# Altium project ctrl_board.PrjPCB
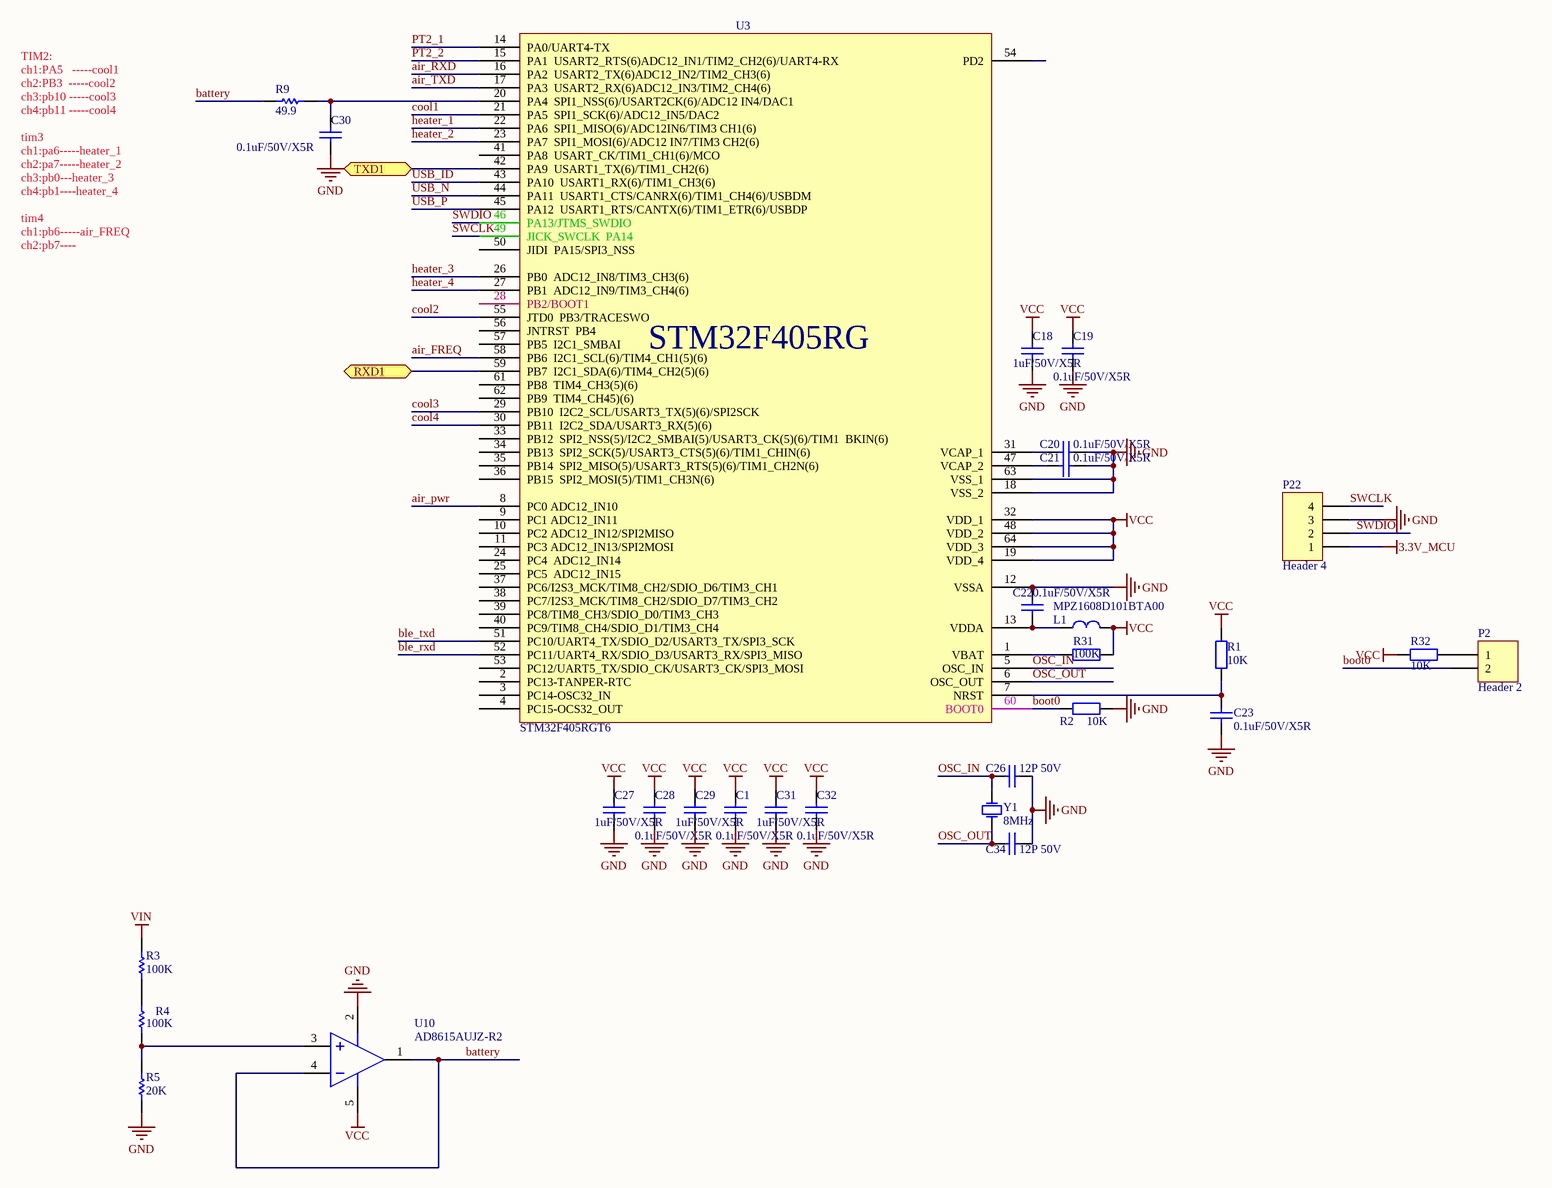
[diagram p0: cpu.SchDoc]
6 sheets, 180 parts. Net scope: flat (ports and power ports of the same name join across sheets).
Sheets:
  cpu.SchDoc
  connector.SchDoc
  power.SchDoc
  drv.SchDoc
  pt100.SchDoc
  lcd.SchDoc

## Sheet cpu.SchDoc
size A3

### Parts
C1  0.1uF/50V/X5R  [0603C]
C18  1uF/50V/X5R  [0603C]
C19  0.1uF/50V/X5R  [0603C]
C20  0.1uF/50V/X5R  [0603C]
C21  0.1uF/50V/X5R  [0603C]
C22  0.1uF/50V/X5R  [0603C]
C23  0.1uF/50V/X5R  [0603C]
C26  12P 50V  [0603C]
C27  1uF/50V/X5R  [0603C]
C28  0.1uF/50V/X5R  [0603C]
C29  1uF/50V/X5R  [0603C]
C30  0.1uF/50V/X5R  [0603C]
C31  1uF/50V/X5R  [0603C]
C32  0.1uF/50V/X5R  [0603C]
C34  12P 50V  [0603C]
L1  MPZ1608D101BTA00  [0603R]
P2  Header 2  [HDR1X2]
P22  Header 4  [HDR1X4]
R1  10K  [0603R]
R2  10K  [0603R]
R3  100K  [0603R]
R4  100K  [0603R]
R5  20K  [0603R]
R9  49.9  [0603R]
R31  100K  [0603R]
R32  10K  [0603R]
U3  STM32F405RGT6  [LQFP-64]
U10  AD8615AUJZ-R2  [sot-23-5]
Y1  8MHz  [CRAY_5032]

### Ports
RXD1 (bidir), TXD1 (bidir)

### Nets
3.3V_MCU: P22.1
GND: C1.1 C18.1 C19.1 C20.1 C21.1 C22.1 C23.1 C26.1 C27.1 C28.1 C29.1 C30.1 C31.1 C32.1 C34.1 P22.3 R2.2 R5.2 U3.12(VSSA) U3.18(VSS_2) U3.63(VSS_1) U10.2(G)
VCC: C1.2 C18.2 C19.2 C27.2 C28.2 C29.2 C31.2 C32.2 L1.2 R1.1 R31.1 R32.2 U3.19(VDD_4) U3.32(VDD_1) U3.48(VDD_2) U3.64(VDD_3) U10.5(VCC)
VIN: R3.1  [project net VCC_Heater]
air_FREQ: U3.58(PB6__I2C1_SCL(6)/TIM4_CH1(5)(6))
air_pwr: U3.8(PC0_ADC12_IN10)
air_RXD: U3.16(PA2__USART2_TX(6)ADC12_IN2/TIM2_CH3(6))
air_TXD: U3.17(PA3__USART2_RX(6)ADC12_IN3/TIM2_CH4(6))
battery: R9.1 U10.1(OS_NUL) U10.4(V-)
ble_rxd: U3.52(PC11/UART4_RX/SDIO_D3/USART3_RX/SPI3_MISO)
ble_txd: U3.51(PC10/UART4_TX/SDIO_D2/USART3_TX/SPI3_SCK)
boot0: P2.2 R2.1 U3.60(BOOT0)
cool1: U3.21(PA5__SPI1_SCK(6)/ADC12_IN5/DAC2)
cool2: U3.55(JTD0__PB3/TRACESWO)
cool3: U3.29(PB10__I2C2_SCL/USART3_TX(5)(6)/SPI2SCK)
cool4: U3.30(PB11__I2C2_SDA/USART3_RX(5)(6))
heater_1: U3.22(PA6__SPI1_MISO(6)/ADC12IN6/TIM3_CH1(6))
heater_2: U3.23(PA7__SPI1_MOSI(6)/ADC12_IN7/TIM3_CH2(6))
heater_3: U3.26(PB0__ADC12_IN8/TIM3_CH3(6))
heater_4: U3.27(PB1__ADC12_IN9/TIM3_CH4(6))
OSC_IN: C26.2 U3.5(OSC_IN) Y1.2(OSC2)
OSC_OUT: C34.2 U3.6(OSC_OUT) Y1.1(OSC1)
PT2_1: U3.14(PA0/UART4-TX)
PT2_2: U3.15(PA1__USART2_RTS(6)ADC12_IN1/TIM2_CH2(6)/UART4-RX)
SWCLK: P22.4 U3.49(JICK_SWCLK__PA14)
SWDIO: P22.2 U3.46(PA13/JTMS_SWDIO)
USB_ID: U3.43(PA10__USART1_RX(6)/TIM1_CH3(6))
USB_N: U3.44(PA11__USART1_CTS/CANRX(6)/TIM1_CH4(6)/USBDM)
USB_P: U3.45(PA12__USART1_RTS/CANTX(6)/TIM1_ETR(6)/USBDP)
NetC20_2: C20.2 U3.31(VCAP_1)
NetC21_2: C21.2 U3.47(VCAP_2)
NetC22_2: C22.2 L1.1 U3.13(VDDA)
NetC23_2: C23.2 R1.2 U3.7(NRST)
NetC30_2: C30.2 R9.2 U3.20(PA4__SPI1_NSS(6)/USART2CK(6)/ADC12_IN4/DAC1)
NetP2_1: P2.1 R32.1
NetR3_2: R3.2 R4.1
NetR4_2: R4.2 R5.1 U10.3(V+)
NetR10#1_2: U3.42(PA9__USART1_TX(6)/TIM1_CH2(6)) ; port TXD1
NetR31_2: R31.2 U3.1(VBAT)
NetR63#1_2: U3.59(PB7__I2C1_SDA(6)/TIM4_CH2(5)(6)) ; port RXD1

Not connected (* = marked no-connect by the designer): U3 2(PC13-TANPER-RTC) 3(PC14-OSC32_IN) 4(PC15-OCS32_OUT) 9(PC1_ADC12_IN11) 10(PC2_ADC12_IN12/SPI2MISO) 11(PC3_ADC12_IN13/SPI2MOSI) 24(PC4__ADC12_IN14) 25(PC5__ADC12_IN15) 28(PB2/BOOT1) 33(PB12__SPI2_NSS(5)/I2C2_SMBAI(5)/USART3_CK(5)(6)/TIM1__BKIN(6)) 34(PB13__SPI2_SCK(5)/USART3_CTS(5)(6)/TIM1_CHIN(6)) 35(PB14__SPI2_MISO(5)/USART3_RTS(5)(6)/TIM1_CH2N(6)) 36(PB15__SPI2_MOSI(5)/TIM1_CH3N(6)) 37(PC6/I2S3_MCK/TIM8_CH2/SDIO_D6/TIM3_CH1) 38(PC7/I2S3_MCK/TIM8_CH2/SDIO_D7/TIM3_CH2) 39(PC8/TIM8_CH3/SDIO_D0/TIM3_CH3) 40(PC9/TIM8_CH4/SDIO_D1/TIM3_CH4) 41(PA8__USART_CK/TIM1_CH1(6)/MCO) 50(JIDI__PA15/SPI3_NSS) 53(PC12/UART5_TX/SDIO_CK/USART3_CK/SPI3_MOSI) 54(PD2) 56(JNTRST__PB4) 57(PB5__I2C1_SMBAI) 61(PB8__TIM4_CH3(5)(6)) 62(PB9__TIM4_CH45)(6))

### Notes on the sheet
- TIM2:
  ch1:PA5   -----cool1
  ch2:PB3  -----cool2
  ch3:pb10 -----cool3
  ch4:pb11 -----cool4
  tim3
  ch1:pa6-----heater_1
  ch2:pa7-----heater_2
  ch3:pb0---heater_3
  ch4:pb1----heater_4
  tim4
  ch1:pb6-----air_FREQ
  ch2:pb7----

### Library data of the parts
C1 C18-C23 C26-C32 C34 = CAP4: 贴片电容 20%
L1 = CIZHU1: 磁珠电感 100R 100MHz
P2 = Header 2: Header, 2-Pin; LatestRevisionDate: 17-Jul-2002; LatestRevisionNote: Re-released for DXP Platform.; Publisher: Altium Limited
P22 = Header 4: Header, 4-Pin; LatestRevisionDate: 17-Jul-2002; LatestRevisionNote: Re-released for DXP Platform.; Publisher: Altium Limited
R1 R2 R31 R32 = RES2: 贴片电阻 5%
R3-R5 R9 = Res1: Resistor; Published: 8-Jun-2000; LatestRevisionDate: 17-Jul-2002; LatestRevisionNote: Re-released for DXP Platform.; PackageReference: AXIAL-0.3; Publisher: Altium Limited
U3 = STM32F405RG: MCU
U10 = AD8615
Y1 = XTAL: 晶振

## Sheet connector.SchDoc
size A4
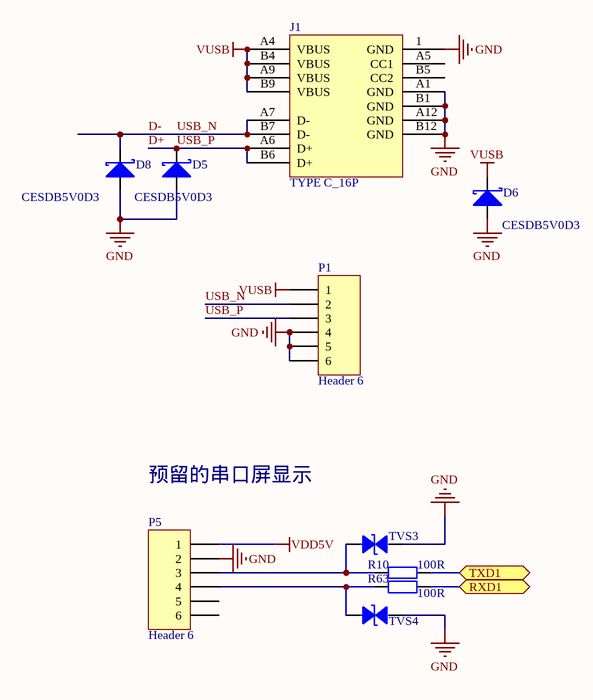
[diagram p1: connector.SchDoc]

### Parts
(Parts that share a designator on the sheet are numbered #1, #2 ... from top to bottom, then left to right.)
D5  CESDB5V0D3  [SOD323]
D6  CESDB5V0D3  [SOD323]
D8  CESDB5V0D3  [SOD323]
J1  TYPE C_16P  [TYPEC_16P]
P1  Header 6  [USB-A]
P5#1  Header 6  [6X2MMZ]
R10#1  100R  [0603R]
R63#1  100R  [0603R]
TVS3#1  ESD5Z5.0CT1G  [SOD-523]  (value not drawn)
TVS4#1  ESD5Z5.0CT1G  [SOD-523]  (value not drawn)

### Ports
RXD1 (bidir), TXD1 (bidir)

### Nets
GND: D5.1(A) D6.1(A) D8.1(A) J1.1(GND) J1.A1(GND) J1.A12(GND) J1.B1(GND) J1.B12(GND) P1.4 P1.5 P1.6 P5#1.2 TVS3#1.1(A) TVS4#1.1(A)
VDD5V: P5#1.1
VUSB: D6.2(K) J1.A4(VBUS) J1.A9(VBUS) J1.B4(VBUS) J1.B9(VBUS) P1.1
D+: D5.2(K) J1.A6(D+) J1.B6(D+) P1.3  [also labelled USB_P]
D-: D8.2(K) J1.A7(D-) J1.B7(D-) P1.2  [also labelled USB_N]
NetP5#1_3: P5#1.3 R10#1.1 TVS3#1.2(B)
NetP5#1_4: P5#1.4 R63#1.1 TVS4#1.2(B)
NetR10#1_2: R10#1.2 ; port TXD1
NetR63#1_2: R63#1.2 ; port RXD1

Not connected (* = marked no-connect by the designer): J1 A5(CC1) B5(CC2); P5#1 5 6

### Notes on the sheet
- 预留的串口屏显示

### Library data of the parts
D5 D6 D8 = DIODE S: Schottky Diode
P1 P5#1 = Header 6: Header, 6-Pin; LatestRevisionDate: 17-Jul-2002; LatestRevisionNote: Re-released for DXP Platform.; Publisher: Altium Limited
R10#1 R63#1 = RES2: 贴片电阻 5%
TVS3#1 TVS4#1 = TVS-1: TVS

## Sheet power.SchDoc
size A4
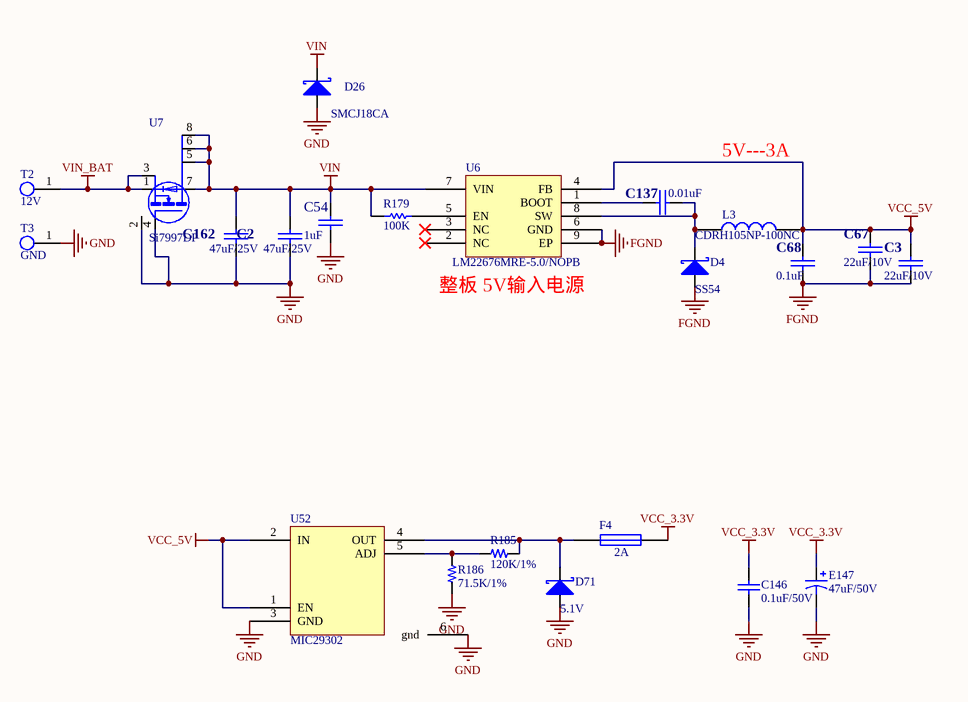
[diagram p2: power.SchDoc]

### Parts
C2  47uF/25V  [1210C]
C3  22uF/10V  [1210C]
C54  1uF  [0603C]
C67  22uF/10V  [1210C]
C68  0.1uF  [0603C]
C137  0.01uF  [0603C]
C146  0.1uF/50V  [0603C]
C162  47uF/25V  [1210C]
D4  SS54  [SMC]
D26  SMCJ18CA  [SMC]
D71  5.1V  [SMA]
E147  47uF/50V  [Φ10×10]
F4  2A  [1812-F]
L3  CDRH105NP-100NC  [CDRH105]
R179  100K  [0603R]
R185  120K/1%  [0603R]
R186  71.5K/1%  [0603R]
T2  12V  [FIX-4.5]
T3  GND  [FIX-4.5]
U6  LM22676MRE-5.0/NOPB  [SOP127P600X168_HS-8N]
U7  Si7997DP  [SC-70(PowerPAK)]
U52  MIC29302  [TO228P1435X457-6N]

### Nets
FGND: C3.2 C67.2 C68.2 D4.1(A) U6.6(GND) U6.9(EP)
GND: C2.2 C54.1 C146.1 C162.2 D26.1(A) D71.1(A) E147.2 R186.1 T3.1 U7.2(G) U7.4(G) U52.3(GND) U52.6(gnd)
VCC_3.3V: C146.2 E147.1 F4.2
VCC_5V: C3.1 C67.1 C68.1 L3.2 U6.4(FB) U52.1(EN) U52.2(IN)
VIN: C2.1 C54.2 C162.1 D26.2(K) R179.2 U6.7(VIN) U7.5(D) U7.6(D) U7.7(D) U7.8(D)  [project net VCC_Heater]
VIN_BAT: T2.1 U7.1(S) U7.3(S)
NetC137_1: C137.1 D4.2(K) L3.1 U6.8(SW)
NetC137_2: C137.2 U6.1(BOOT)
NetD71_2: D71.2(K) F4.1 R185.1 U52.4(OUT)
NetR179_1: R179.1 U6.5(EN)
NetR185_2: R185.2 R186.2 U52.5(ADJ)

Not connected (* = marked no-connect by the designer): U6 2(NC)* 3(NC)*

### Notes on the sheet
- 5V---3A
- (near U6) 整板 5V输入电源

### Library data of the parts
C2 C3 C54 C67 C68 C137 C162 = CAP: Capacitor
C146 = Cap: Capacitor; Value: 22nF; Published: 8-Jun-2000; LatestRevisionDate: 17-Jul-2002; LatestRevisionNote: Re-released for DXP Platform.; PackageReference: RAD-0.3; Publisher: Altium Limited; PackageDescription: Radial Cap, Thru-Hole; 2 Leads; 0.3 in Pin Spacing
D4 D26 D71 = DIODE S: Schottky Diode
E147 = Cap Pol1: Polarized Capacitor (Radial); Value: 100pF; Published: 8-Jun-2000; LatestRevisionDate: 17-Jul-2002; LatestRevisionNote: Re-released for DXP Platform.; PackageReference: RB7.6-15; Publisher: Altium Limited
F4 = Fuse 1: Fuse; Published: 8-Jun-2000; LatestRevisionDate: 17-Jul-2002; LatestRevisionNote: Re-released for DXP Platform.; PackageReference: PIN-W2/E2.8; Publisher: Altium Limited; PackageDescription: Thru-Hole; 2 Leads
L3 = INDUCTOR
R179 = Res1: Resistor; Published: 8-Jun-2000; LatestRevisionDate: 17-Jul-2002; LatestRevisionNote: Re-released for DXP Platform.; PackageReference: AXIAL-0.3; Publisher: Altium Limited
R185 R186 = R
T2 T3 = TP
U6 = LM22676MR-5.0
U7 = Si7997DP: Sia430DJ

## Sheet drv.SchDoc
size A2
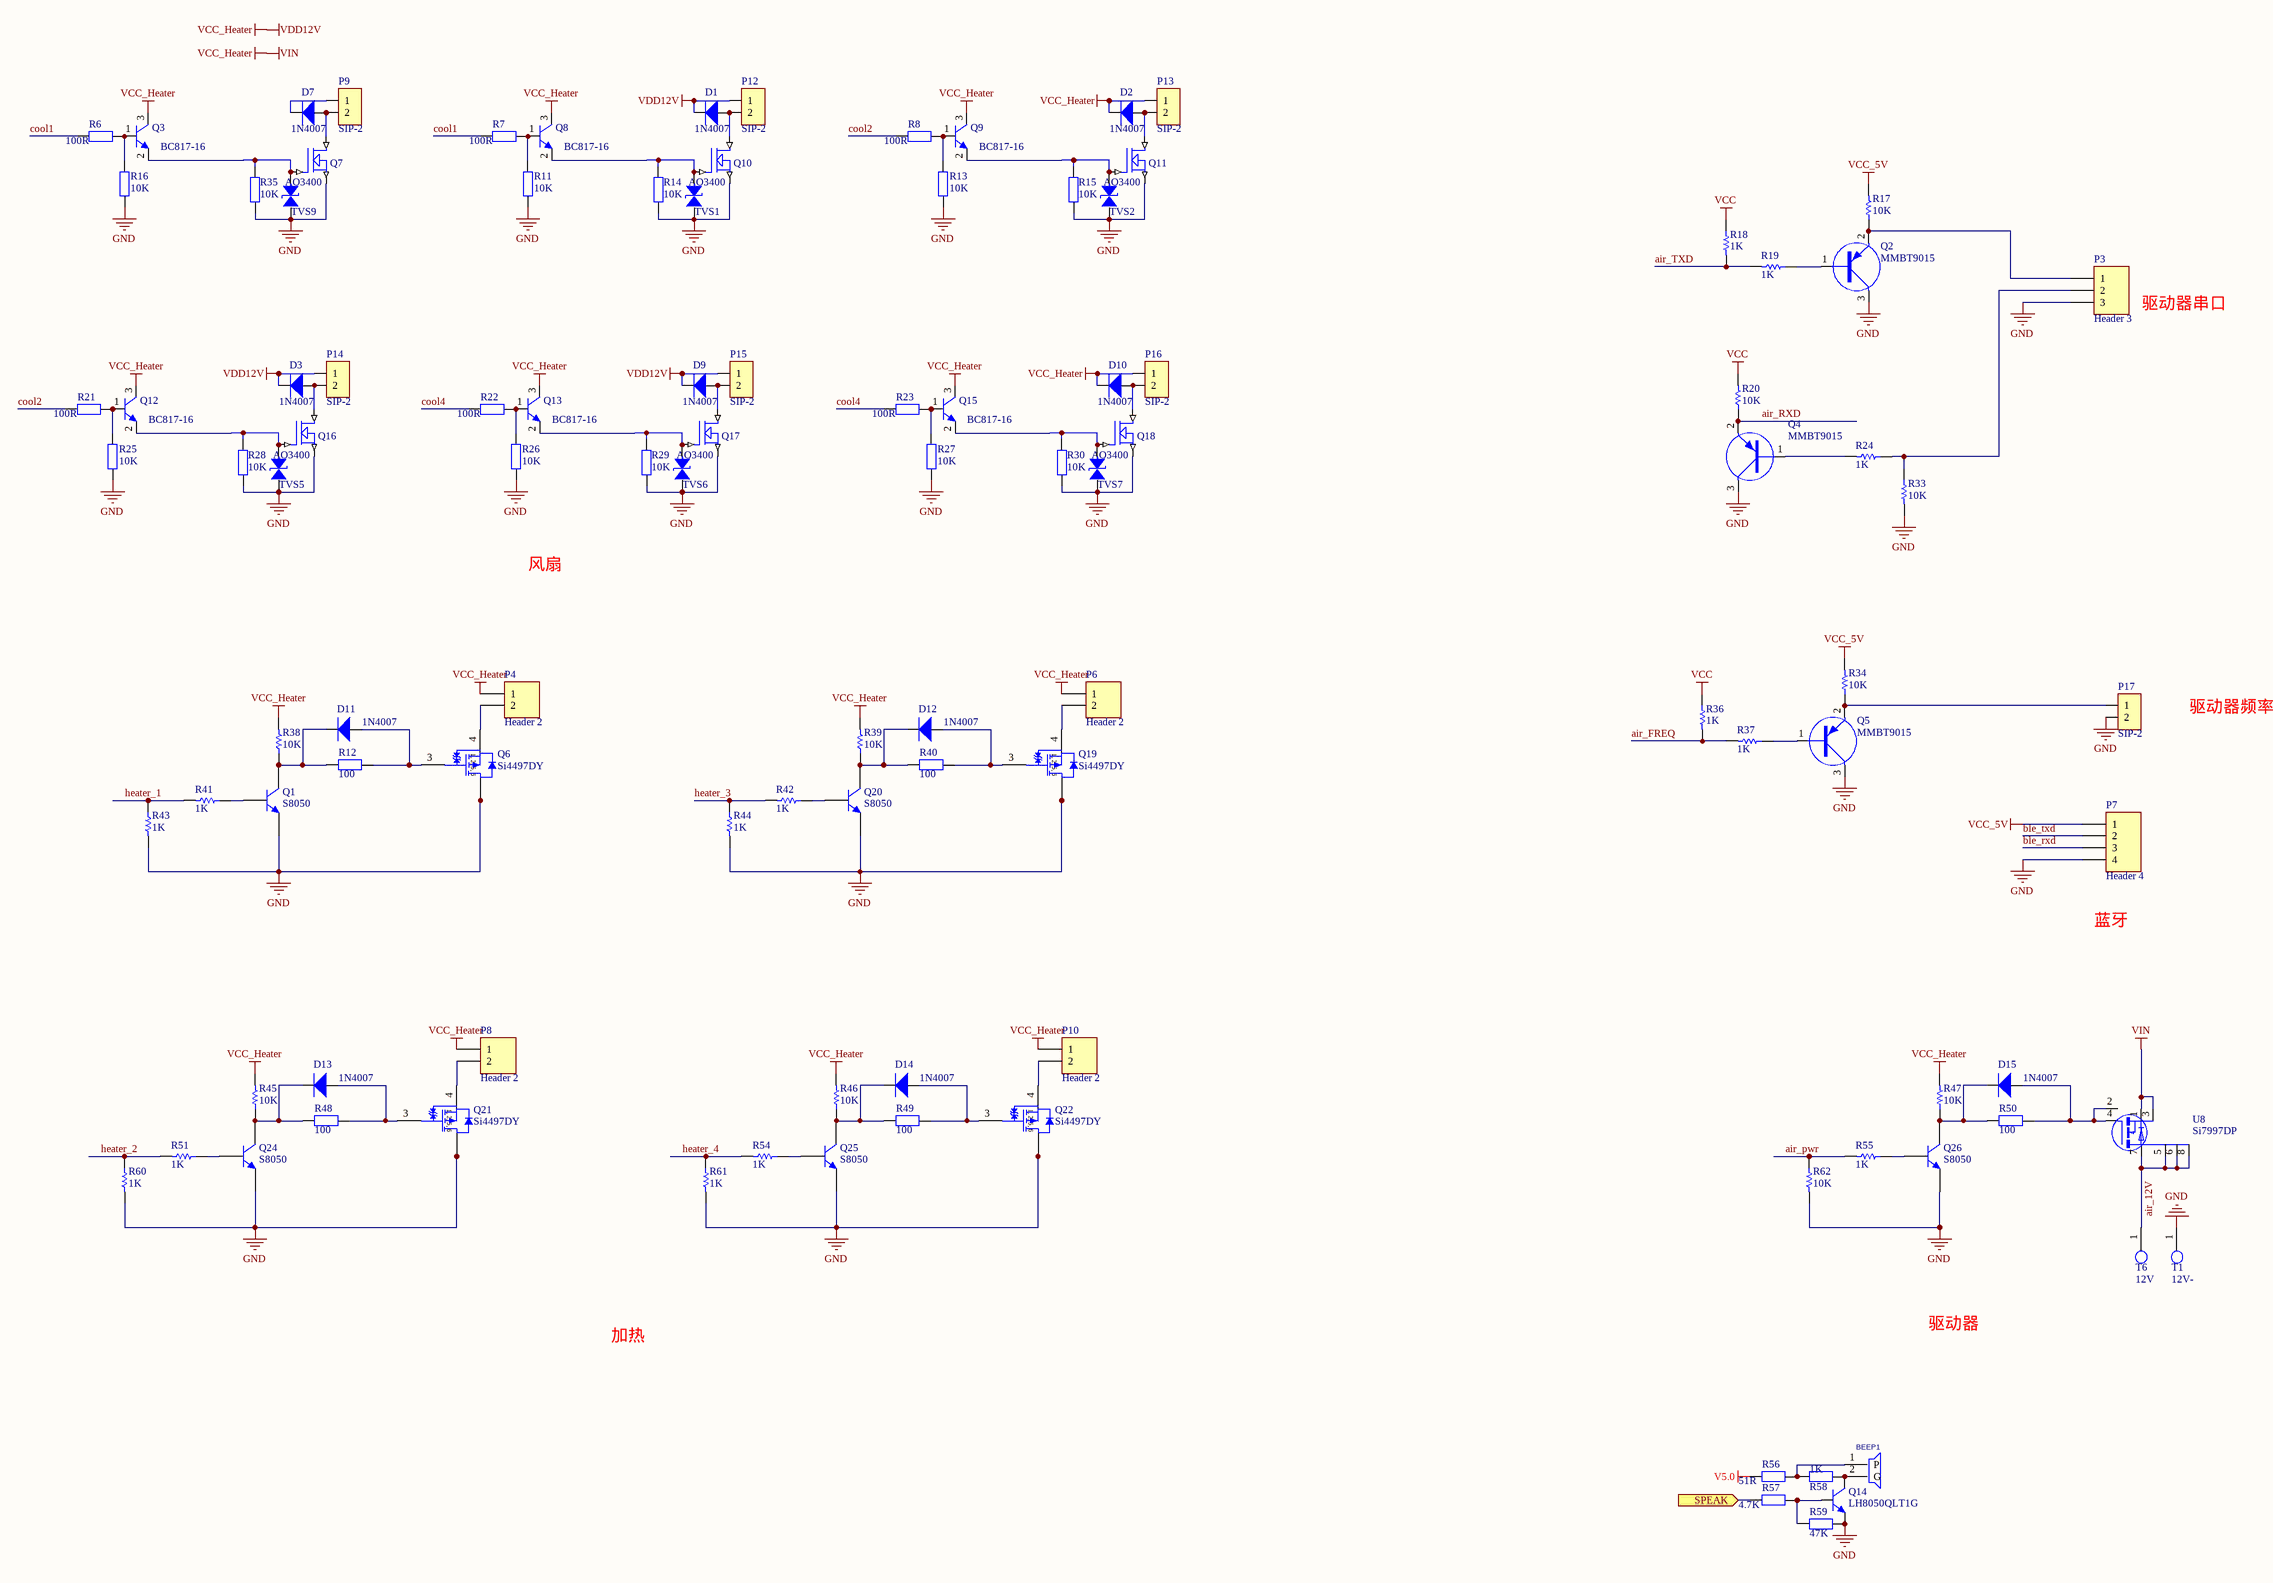
[diagram p3: drv.SchDoc]

### Parts
BEEP1  BEEP-9.5X5.5  [BEEP-9.5X5.5]  (value not drawn)
D1  1N4007  [DO-214-AC]
D2  1N4007  [DO-214-AC]
D3  1N4007  [DO-214-AC]
D7  1N4007  [DO-214-AC]
D9  1N4007  [DO-214-AC]
D10  1N4007  [DO-214-AC]
D11  1N4007  [DO-214-AC]
D12  1N4007  [DO-214-AC]
D13  1N4007  [DO-214-AC]
D14  1N4007  [DO-214-AC]
D15  1N4007  [DO-214-AC]
P3  Header 3  [HDR1X3]
P4  Header 2  [HDR1X2]
P6  Header 2  [HDR1X2]
P7  Header 4  [HDR1X4]
P8  Header 2  [HDR1X2]
P9  SIP-2  [SIP-2A]
P10  Header 2  [HDR1X2]
P12  SIP-2  [SIP-2A]
P13  SIP-2  [SIP-2A]
P14  SIP-2  [SIP-2A]
P15  SIP-2  [SIP-2A]
P16  SIP-2  [SIP-2A]
P17  SIP-2  [SIP-2A]
Q1  S8050  [SOT23-3]
Q2  MMBT9015  [SOT23-3]
Q3  BC817-16  [SOT-23]
Q4  MMBT9015  [SOT23-3]
Q5  MMBT9015  [SOT23-3]
Q6  Si4497DY
Q7  AO3400  [SOT-23]
Q8  BC817-16  [SOT-23]
Q9  BC817-16  [SOT-23]
Q10  AO3400  [SOT-23]
Q11  AO3400  [SOT-23]
Q12  BC817-16  [SOT-23]
Q13  BC817-16  [SOT-23]
Q14  LH8050QLT1G  [SOT-23]
Q15  BC817-16  [SOT-23]
Q16  AO3400  [SOT-23]
Q17  AO3400  [SOT-23]
Q18  AO3400  [SOT-23]
Q19  Si4497DY
Q20  S8050  [SOT23-3]
Q21  Si4497DY
Q22  Si4497DY
Q24  S8050  [SOT23-3]
Q25  S8050  [SOT23-3]
Q26  S8050  [SOT23-3]
R6  100R  [0603R]
R7  100R  [0603R]
R8  100R  [0603R]
R11  10K  [0603R]
R12  100  [0603R]
R13  10K  [0603R]
R14  10K  [0603R]
R15  10K  [0603R]
R16  10K  [0603R]
R17  10K  [0603R]
R18  1K  [0603R]
R19  1K  [0603R]
R20  10K  [0603R]
R21  100R  [0603R]
R22  100R  [0603R]
R23  100R  [0603R]
R24  1K  [0603R]
R25  10K  [0603R]
R26  10K  [0603R]
R27  10K  [0603R]
R28  10K  [0603R]
R29  10K  [0603R]
R30  10K  [0603R]
R33  10K  [0603R]
R34  10K  [0603R]
R35  10K  [0603R]
R36  1K  [0603R]
R37  1K  [0603R]
R38  10K  [0603R]
R39  10K  [0603R]
R40  100  [0603R]
R41  1K  [0603R]
R42  1K  [0603R]
R43  1K  [0603R]
R44  1K  [0603R]
R45  10K  [0603R]
R46  10K  [0603R]
R47  10K  [0603R]
R48  100  [0603R]
R49  100  [0603R]
R50  100  [0603R]
R51  1K  [0603R]
R54  1K  [0603R]
R55  1K  [0603R]
R56  51R  [0603R]
R57  4.7K  [0603R]
R58  1K  [0603R]
R59  47K  [0603R]
R60  1K  [0603R]
R61  1K  [0603R]
R62  10K  [0603R]
T1  12V-  [FIX-4.5]
T6  12V  [FIX-4.5]
TVS1  ESD5Z5.0CT1G  [SOD-523]  (value not drawn)
TVS2  ESD5Z5.0CT1G  [SOD-523]  (value not drawn)
TVS5  ESD5Z5.0CT1G  [SOD-523]  (value not drawn)
TVS6  ESD5Z5.0CT1G  [SOD-523]  (value not drawn)
TVS7  ESD5Z5.0CT1G  [SOD-523]  (value not drawn)
TVS9  ESD5Z5.0CT1G  [SOD-523]  (value not drawn)
U8  Si7997DP  [SC-70(PowerPAK)]

### Ports
SPEAK (in)

### Nets
GND: P3.3 P7.4 P17.2 Q1.2(E) Q2.3(C) Q4.3(C) Q5.3(C) Q6.1(D) Q6.2(D) Q6.5(D) Q6.6(D) Q7.2(S) Q10.2(S) Q11.2(S) Q14.2(E) Q16.2(S) Q17.2(S) Q18.2(S) Q19.1(D) Q19.2(D) Q19.5(D) Q19.6(D) Q20.2(E) Q21.1(D) Q21.2(D) Q21.5(D) Q21.6(D) Q22.1(D) Q22.2(D) Q22.5(D) Q22.6(D) Q24.2(E) Q25.2(E) Q26.2(E) R11.1 R13.1 R14.2 R15.2 R16.1 R25.1 R26.1 R27.1 R28.2 R29.2 R30.2 R33.2 R35.2 R43.2 R44.2 R59.2 R60.2 R61.2 R62.2 T1.1 TVS1.1(A) TVS2.1(A) TVS5.1(A) TVS6.1(A) TVS7.1(A) TVS9.1(A)
V5.0: R56.2
VCC: R18.1 R20.2 R36.1
VCC_5V: P7.1 R17.2 R34.2
VCC_Heater: D1.2(K) D2.2(K) D3.2(K) D9.2(K) D10.2(K) P4.1 P6.1 P8.1 P10.1 P12.1 P13.1 P14.1 P15.1 P16.1 Q3.3(C) Q8.3(C) Q9.3(C) Q12.3(C) Q13.3(C) Q15.3(C) R38.2 R39.2 R45.2 R46.2 R47.2 U8.1(S) U8.3(S)  [also labelled VDD12V, VIN]
air_12V: T6.1 U8.5(D) U8.6(D) U8.7(D) U8.8(D)
air_FREQ: R36.2 R37.2
air_pwr: R55.2 R62.1
air_RXD: Q4.2(E) R20.1
air_TXD: R18.2 R19.2
ble_rxd: P7.3
ble_txd: P7.2
cool1: R6.2 R7.2
cool2: R8.2 R21.2
cool4: R22.2 R23.2
heater_1: R41.2 R43.1
heater_2: R51.2 R60.1
heater_3: R42.2 R44.1
heater_4: R54.2 R61.1
NetBEEP1_1: BEEP1.1(P) R56.1 R58.2
NetBEEP1_2: BEEP1.2(G) Q14.3(C) R58.1
NetD1_1: D1.1(A) P12.2 Q10.3(D)
NetD2_1: D2.1(A) P13.2 Q11.3(D)
NetD3_1: D3.1(A) P14.2 Q16.3(D)
NetD7_1: D7.1(A) P9.2 Q7.3(D)
NetD7_2: D7.2(K) P9.1
NetD9_1: D9.1(A) P15.2 Q17.3(D)
NetD10_1: D10.1(A) P16.2 Q18.3(D)
NetD11_1: D11.1(A) Q6.3(G) R12.2
NetD11_2: D11.2(K) Q1.3(C) R12.1 R38.1
NetD12_1: D12.1(A) Q19.3(G) R40.2
NetD12_2: D12.2(K) Q20.3(C) R39.1 R40.1
NetD13_1: D13.1(A) Q21.3(G) R48.2
NetD13_2: D13.2(K) Q24.3(C) R45.1 R48.1
NetD14_1: D14.1(A) Q22.3(G) R49.2
NetD14_2: D14.2(K) Q25.3(C) R46.1 R49.1
NetD15_1: D15.1(A) R50.2 U8.2(G) U8.4(G)
NetD15_2: D15.2(K) Q26.3(C) R47.1 R50.1
NetP3_1: P3.1 Q2.2(E) R17.1
NetP3_2: P3.2 R24.1 R33.1
NetP4_2: P4.2 Q6.4(S)
NetP6_2: P6.2 Q19.4(S)
NetP8_2: P8.2 Q21.4(S)
NetP10_2: P10.2 Q22.4(S)
NetP17_1: P17.1 Q5.2(E) R34.1
NetQ1_1: Q1.1(B) R41.1
NetQ2_1: Q2.1(B) R19.1
NetQ3_1: Q3.1(B) R6.1 R16.2
NetQ3_2: Q3.2(E) Q7.1(G) R35.1 TVS9.2(B)
NetQ4_1: Q4.1(B) R24.2
NetQ5_1: Q5.1(B) R37.1
NetQ8_1: Q8.1(B) R7.1 R11.2
NetQ8_2: Q8.2(E) Q10.1(G) R14.1 TVS1.2(B)
NetQ9_1: Q9.1(B) R8.1 R13.2
NetQ9_2: Q9.2(E) Q11.1(G) R15.1 TVS2.2(B)
NetQ12_1: Q12.1(B) R21.1 R25.2
NetQ12_2: Q12.2(E) Q16.1(G) R28.1 TVS5.2(B)
NetQ13_1: Q13.1(B) R22.1 R26.2
NetQ13_2: Q13.2(E) Q17.1(G) R29.1 TVS6.2(B)
NetQ14_1: Q14.1(B) R57.2 R59.1
NetQ15_1: Q15.1(B) R23.1 R27.2
NetQ15_2: Q15.2(E) Q18.1(G) R30.1 TVS7.2(B)
NetQ20_1: Q20.1(B) R42.1
NetQ24_1: Q24.1(B) R51.1
NetQ25_1: Q25.1(B) R54.1
NetQ26_1: Q26.1(B) R55.1
NetR57_1: R57.1 ; port SPEAK

### Notes on the sheet
- 驱动器串口
- 风扇
- 驱动器频率控制
- 蓝牙
- 加热
- 驱动器
- (in symbol SQ3419AEEV-T1_GE3) 1, 2, 5, 6

### Library data of the parts
D1-D3 D7 D9-D15 = DIODE2: 贴片二极管
P3 = Header 3: Header, 3-Pin; LatestRevisionDate: 17-Jul-2002; LatestRevisionNote: Re-released for DXP Platform.; Publisher: Altium Limited
P4 P6 P8 P10 = Header 2: Header, 2-Pin; LatestRevisionDate: 17-Jul-2002; LatestRevisionNote: Re-released for DXP Platform.; Publisher: Altium Limited
P7 = Header 4: Header, 4-Pin; LatestRevisionDate: 17-Jul-2002; LatestRevisionNote: Re-released for DXP Platform.; Publisher: Altium Limited
P9 P12-P17 = SIP-2: XH2.54 2P 立贴
Q1 Q20 Q24-Q26 = NPN: NPN Bipolar Transistor; Published: 8-Jun-2000; LatestRevisionDate: 17-Jul-2002; LatestRevisionNote: Re-released for DXP Platform.; PackageReference: TO-226; Publisher: Altium Limited; Code_JEDEC: TO-226-AA
Q2 Q4 Q5 = PNP
Q3 Q8 Q9 Q12 Q13 Q15 = NPN-1: 三极管
Q6 Q19 Q21 Q22 = SQ3419AEEV-T1_GE3: Automotive P-Channel MOSFET, 6.9 A, 40 V, -55 to 175 degC, 6-Pin TSOP, RoHS, Tape and Reel; Manufacturer: International Rectifier; Rated Power Dissipation: 2W; Qg Gate Charge: 25nC; Drain-to-Source Voltage [Vdss]: 40V; Drain-Source On Resistance-Max: 112mO; Channel Type: P-Channel; Package Description: 6-Pin Thin Small Outline Package, Body 3 x 1.65 mm, Pitch 1.00 mm; Datasheet URL: https://www.vishay.com/docs/65332/sq3419aeev.pdf; Mounting Technology: SurfaceMount; Package Reference: TSOP-6; Manufacturer URL: https://www.vishay.com/; Datasheet Version: 04/2010
Q7 Q10 Q11 Q16-Q18 = MOSFET N
Q14 = NPN-1: NPN
R6-R8 R11-R16 R21-R23 R25-R30 R35 R40 R48-R50 = RES-SOP: 贴片电阻 5%
R17-R20 R24 R33 R34 R36-R39 R41-R47 R51 R54 R55 R60-R62 = Res1: Resistor; Published: 8-Jun-2000; LatestRevisionDate: 17-Jul-2002; LatestRevisionNote: Re-released for DXP Platform.; PackageReference: AXIAL-0.3; Publisher: Altium Limited
R56-R59 = RES0: 贴片电阻 5%
T1 T6 = TP
TVS1 TVS2 TVS5-TVS7 TVS9 = TVS-1: TVS
U8 = Si7997DP: Sia430DJ
BEEP1 = BEEP-9.5X5.5: PCB DECAL: BEEP-9.5X5.5

## Sheet pt100.SchDoc
size A4
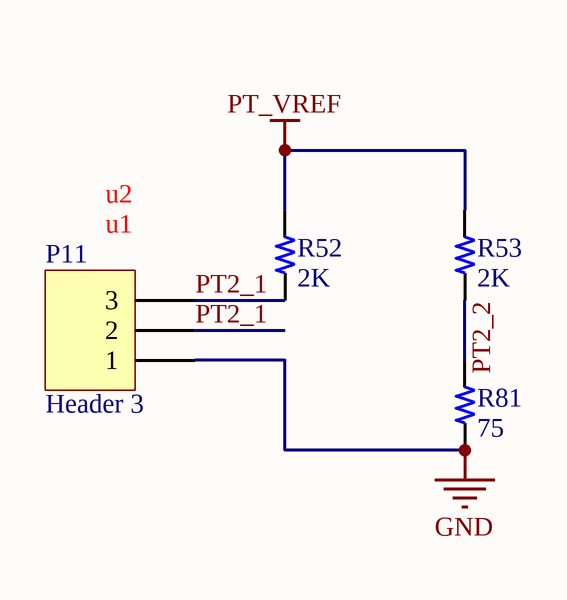
[diagram p4: pt100.SchDoc]

### Parts
P11  Header 3  [KF7.62-3P]
R52  2K  [0603R]
R53  2K  [0603R]
R81  75  [0603R]

### Nets
GND: P11.1 R81.1
PT_VREF: R52.2 R53.2
PT2_1: P11.2 P11.3 R52.1
PT2_2: R53.1 R81.2

### Notes on the sheet
- (near P11) u1
- (near P11) u2

### Library data of the parts
P11 = Header 3: Header, 3-Pin; LatestRevisionDate: 17-Jul-2002; LatestRevisionNote: Re-released for DXP Platform.; Publisher: Altium Limited
R52 R53 = R: Value: 2K/1%
R81 = R: Value: 75

## Sheet lcd.SchDoc
size A4
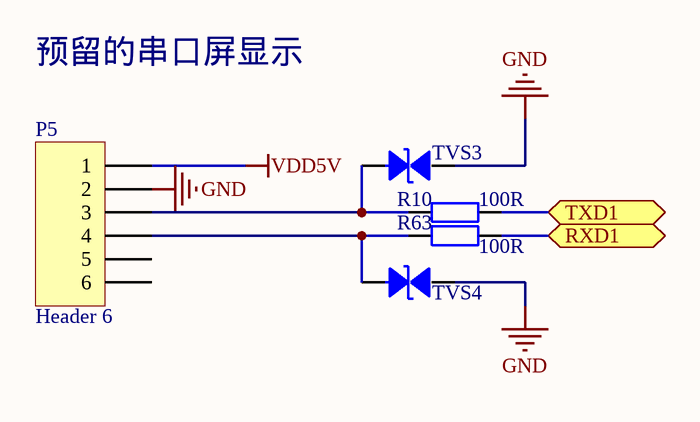
[diagram p5: lcd.SchDoc]

### Parts
(Parts that share a designator on the sheet are numbered #1, #2 ... from top to bottom, then left to right.)
P5#2  Header 6  [6X2MMZ]
R10#2  100R  [0603R]
R63#2  100R  [0603R]
TVS3#2  ESD5Z5.0CT1G  [SOD-523]  (value not drawn)
TVS4#2  ESD5Z5.0CT1G  [SOD-523]  (value not drawn)

### Ports
RXD1 (bidir), TXD1 (bidir)

### Nets
GND: P5#2.2 TVS3#2.1(A) TVS4#2.1(A)
VDD5V: P5#2.1
NetP5#2_3: P5#2.3 R10#2.1 TVS3#2.2(B)
NetP5#2_4: P5#2.4 R63#2.1 TVS4#2.2(B)
NetR10#1_2: R10#2.2 ; port TXD1
NetR63#1_2: R63#2.2 ; port RXD1

Not connected (* = marked no-connect by the designer): P5#2 5 6

### Notes on the sheet
- 预留的串口屏显示

### Library data of the parts
P5#2 = Header 6: Header, 6-Pin; LatestRevisionDate: 17-Jul-2002; LatestRevisionNote: Re-released for DXP Platform.; Publisher: Altium Limited
R10#2 R63#2 = RES2: 贴片电阻 5%
TVS3#2 TVS4#2 = TVS-1: TVS

## Nets that join several sheets
GND: cpu (22 pins), connector (14 pins), power (13 pins), drv (60 pins), pt100 (P11.1 R81.1), lcd (P5#2.2 TVS3#2.1 TVS4#2.1)
VCC: cpu (17 pins), drv (R18.1 R20.2 R36.1)
VCC_5V: power (7 pins), drv (P7.1 R17.2 R34.2)
VCC_Heater: cpu (R3.1), power (10 pins), drv (27 pins)
VDD5V: connector (P5#1.1), lcd (P5#2.1)
NetR10#1_2: cpu (U3.42), connector (R10#1.2), lcd (R10#2.2)
NetR63#1_2: cpu (U3.59), connector (R63#1.2), lcd (R63#2.2)